# Altium schematic sheet Connectors.SchDoc
size A4; SheetNumber: 7; SheetTotal: 7
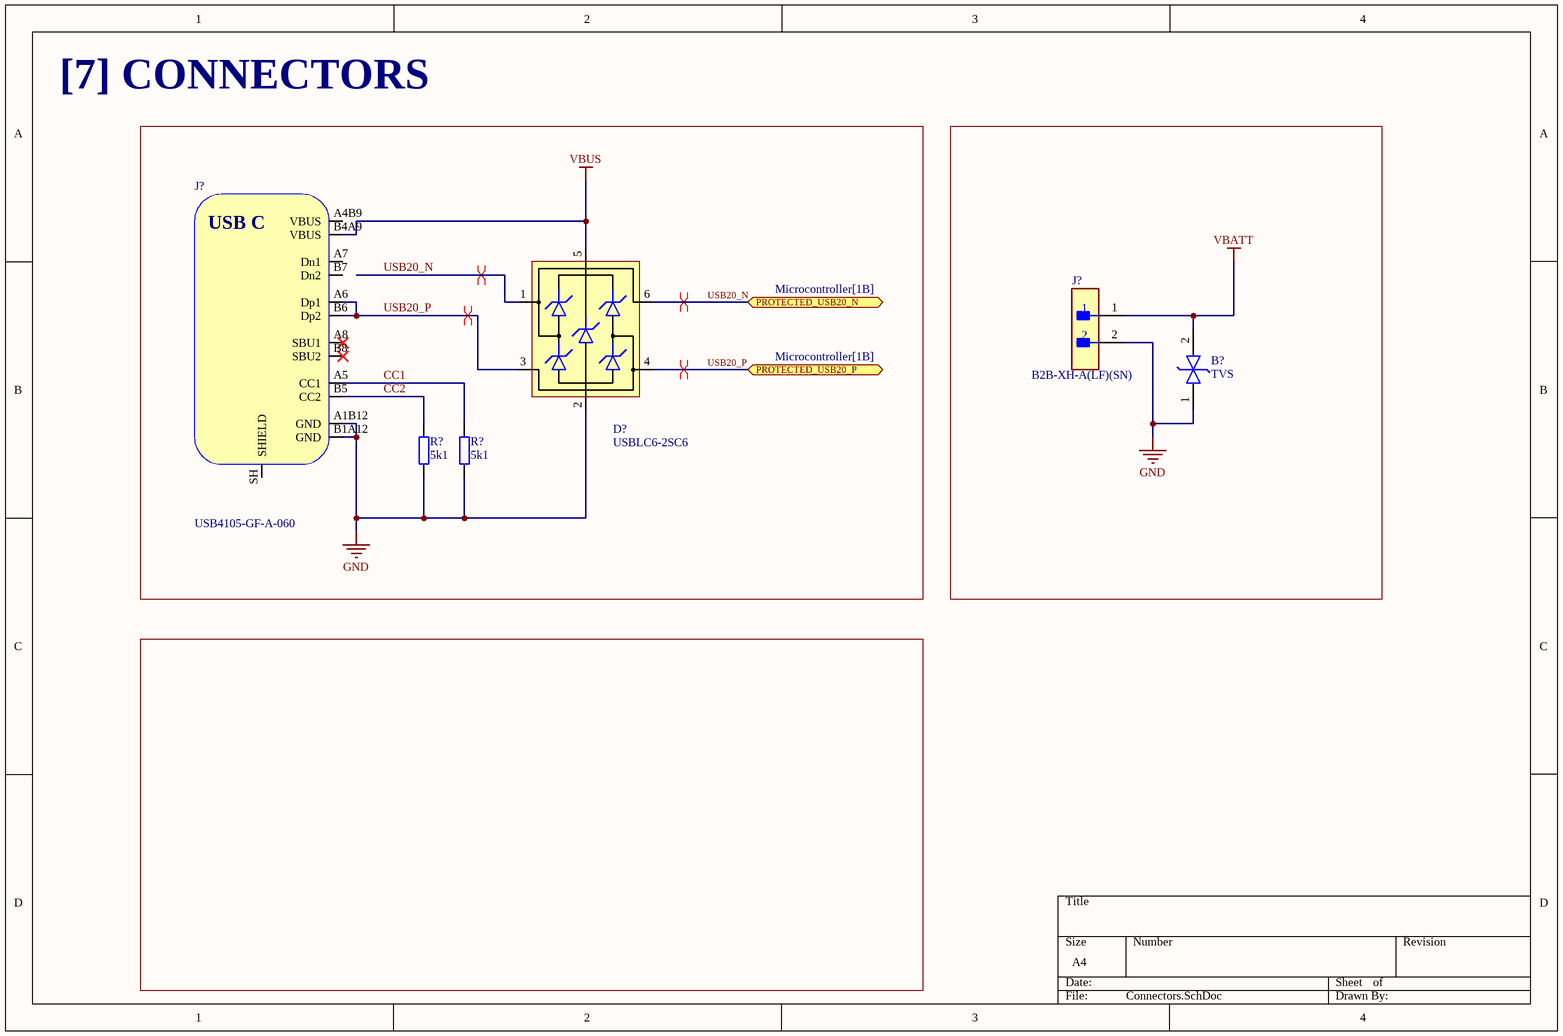
[diagram p0: Connectors.SchDoc]

## Parts
(Parts that share a designator on the sheet are numbered #1, #2 ... from top to bottom, then left to right.)
B?  TVS  [SODFL1608X65N]
D?  USBLC6-2SC6  [SOT-23-6]
J?#1  B2B-XH-A(LF)(SN)  [FP-B2B-XH-A_LF_SN-MFG]
J?#2  USB4105-GF-A-060  [USB4105-GF-A-060]
R?#1  5k1  [RES_0402]
R?#2  5k1  [RES_0402]

## Ports
PROTECTED_USB20_N (bidir, see Microcontroller[1B]), PROTECTED_USB20_P (bidir, see Microcontroller[1B])

## Nets
GND: B?.1(K1) D?.2(GND) J?#1.2 J?#2.A1B12(GND) J?#2.B1A12(GND) R?#1.2 R?#2.2
VBATT: B?.2(K2) J?#1.1
VBUS: D?.5(VBUS) J?#2.B4A9(VBUS)
CC1: J?#2.A5(CC1) R?#2.1
CC2: J?#2.B5(CC2) R?#1.1
USB20_N: D?.1(IO1) D?.6(IO1) ; port PROTECTED_USB20_N
USB20_P: D?.3(IO2) D?.4(IO2) J?#2.A6(Dp1) J?#2.B6(Dp2) ; port PROTECTED_USB20_P

Not connected (* = marked no-connect by the designer): J?#2 A4B9(VBUS) A7(Dn1) A8(SBU1)* B7(Dn2) B8(SBU2)* SH(SHIELD)

## Layout directives
differential pair; net class USB_FS: USB20_N, USB20_P

## Notes on the sheet
- [7] CONNECTORS
- (in symbol USB4105-GF-A-060) USB C

## Library data of the parts
B? = PESD5V0S1BB_115: PESD5V0S1BB - Bidirectional ESD protection diode Vbr = 5.5V, Vc; Manufacturer_Name: Nexperia; Manufacturer_Part_Number: PESD5V0S1BB,115; Geometry.Height: 0.65mm; Mouser Part Number: 771-PESD5V0S1BB-T/R; Mouser Price/Stock: https://www.mouser.co.uk/ProductDetail/Nexperia/PESD5V0S1BB115?qs=LOCUfHb8d9vW06zz0pOppQ%3D%3D; Arrow Part Number: PESD5V0S1BB,115; Arrow Price/Stock: https://www.arrow.com/en/products/pesd5v0s1bb115/nexperia; Datasheet Link: https://assets.nexperia.com/documents/data-sheet/PESD5V0S1BB.pdf
D? = USBLC6-2SC6: Low-Capacitance ESD Protection USB; Manufacturer: STMicroelectronics; Manufacturer Part Number: USBLC6-2SC6; Distributor Link: https://www.mouser.de/ProductDetail/STMicroelectronics/USBLC6-2SC6?qs=po45yt2pPpu%2FhNIlwQdTlg%3D%3D
J?#1 = CMP-2000-05888-3: CONN HEADER VERT 2POS 2.5MM; Current Rating: 3A; Voltage Rating: 250V; Number of Contacts: 2; Contact Resistance: 20mR; Wire/Cable Gauge: 22AWG; Insulation Resistance: 1GR; Connector Type: Male Pin; Packaging: Bulk; Contact Material: Brass; Lead Free: Lead Free; Orientation: Straight; Contact Plating: Tin; Max Current Rating: 3A; Termination: Solder; Fastening Type: Detent; Depth: 5.75mm; Housing Material: Polyamide; REACH SVHC: No SVHC; Series: XH; Voltage Rating (AC): 250V; Number of Positions: 2; Color: Natural; Contact Type: Male Pin; Max Voltage Rating (DC): 250V; Pitch: 2.5mm; Lead Pitch: 2.5mm; Mount: Through Hole; Max Operating Temperature: 85°C; Length: 7.4mm; Max Voltage Rating (AC): 250V; Min Operating Temperature: -25°C; Number of Rows: 1; Housing Color: White
J?#2 = USB4105-GF-A-060: USB Connector Type C SMT 12 Pin; Manufacturer: GCT; Manufacturer Part Number: USB4105-GF-A-060; Distributor Link: https://eu.mouser.com/ProductDetail/GCT/USB4105-GF-A-060?qs=QNEnbhJQKvY2mocwNJzgfA%3D%3D
R?#1 R?#2 = RES_0402: Resistor SMD 0402; Manufacturer: *; Manufacturer Part Number: *; Distributor Link: *; LCSC: *